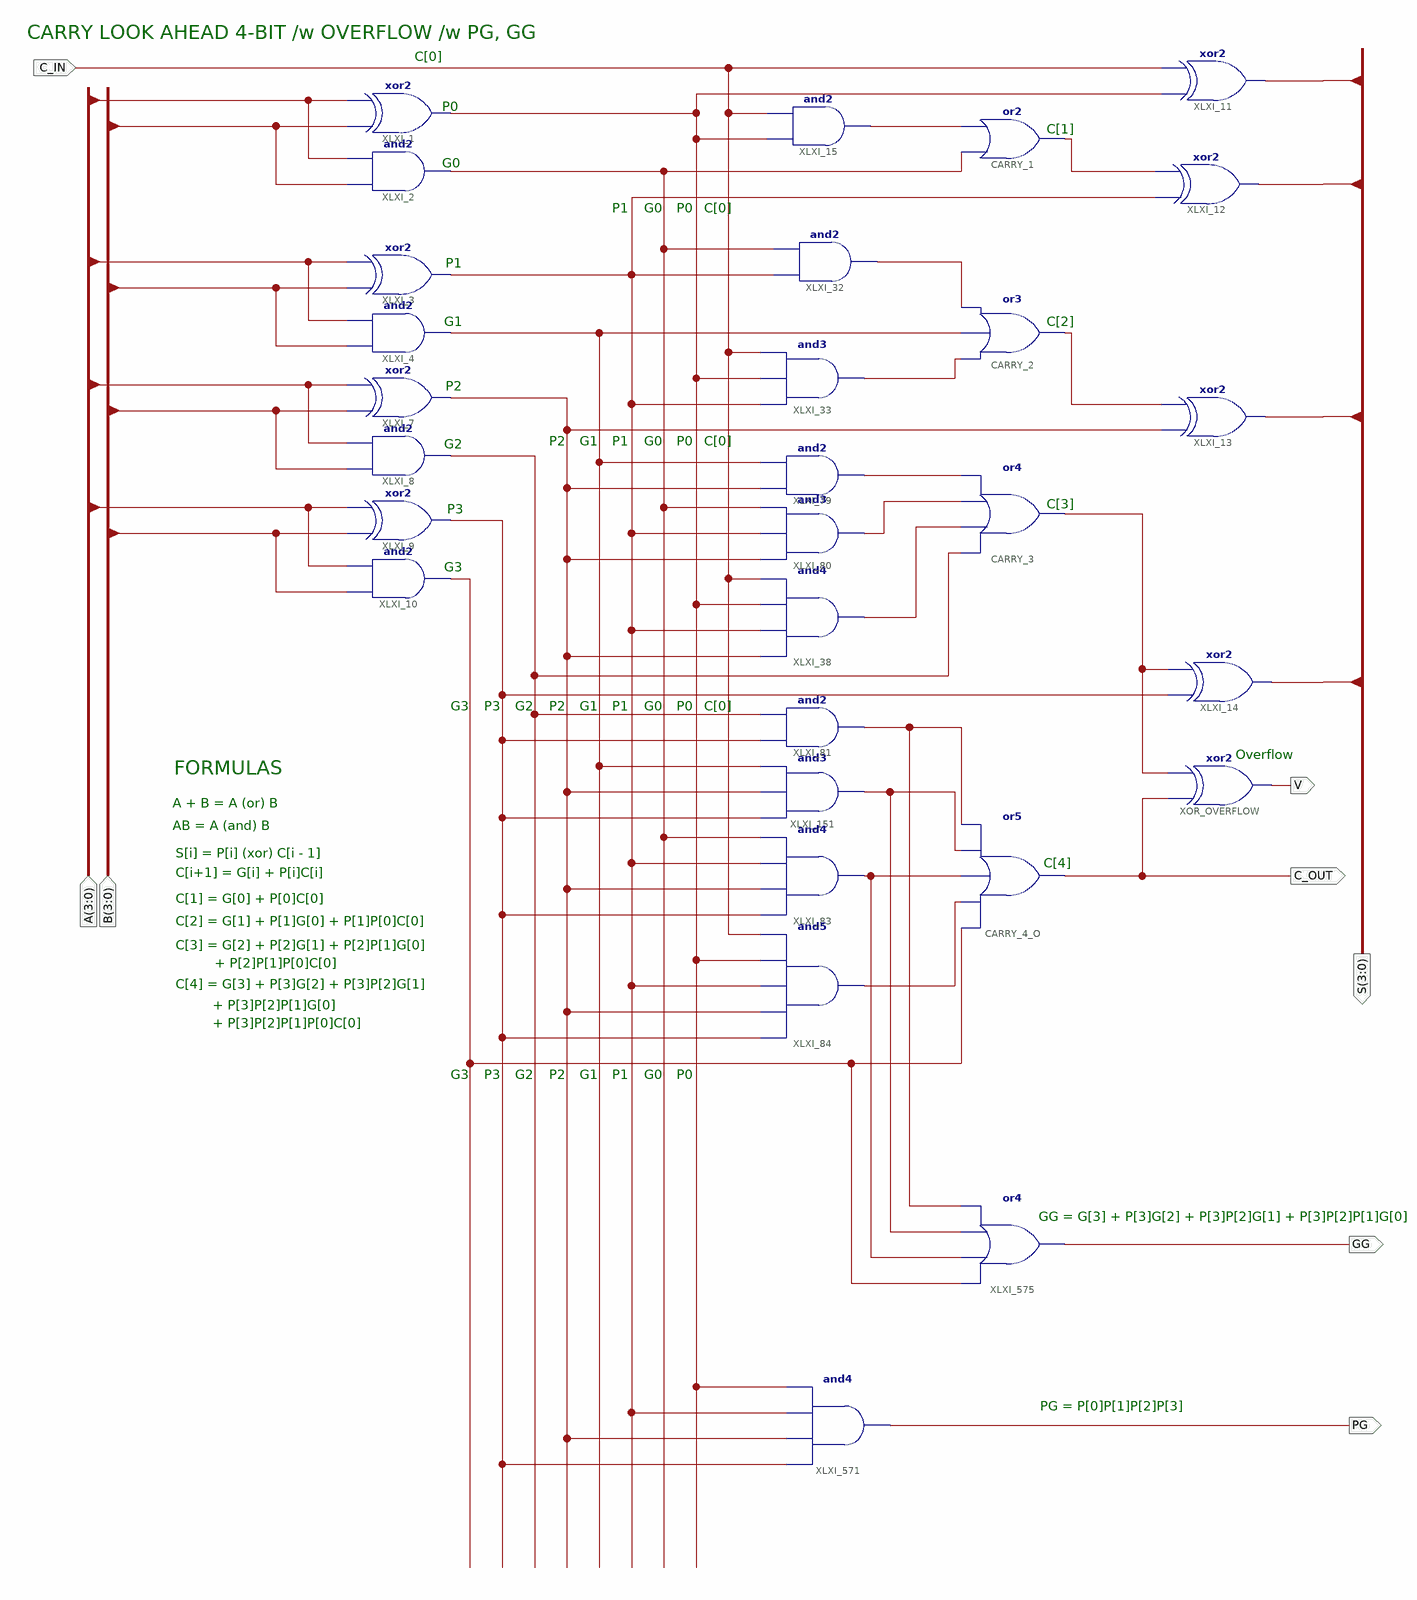
[diagram p0: schematic sheet 1]
// Xilinx ISE schematic cla4bit.sch (spartan3e) as structural Verilog: 29 symbols, 8 ports
module cla4bit (
  input  C_IN,
  input  [3:0] B,
  input  [3:0] A,
  output V,
  output C_OUT,
  output PG,
  output GG,
  output [3:0] S
);

  wire C_3, XLXN_21, XLXN_26, XLXN_43, XLXN_52, XLXN_60, XLXN_62, XLXN_66, XLXN_67, XLXN_68, XLXN_69,
       XLXN_70, XLXN_75, XLXN_143, XLXN_145, XLXN_150, XLXN_293, XLXN_1487, XLXN_1488, XLXN_1489, XLXN_1490;

  or CARRY_1 (XLXN_52, XLXN_43, XLXN_26);
  or CARRY_2 (XLXN_75, XLXN_67, XLXN_62, XLXN_66);
  and XLXI_38 (XLXN_150, XLXN_68, XLXN_60, XLXN_21, C_IN);
  and XLXI_80 (XLXN_143, XLXN_68, XLXN_60, XLXN_43);
  and XLXI_79 (XLXN_145, XLXN_68, XLXN_62);
  or CARRY_3 (C_3, XLXN_69, XLXN_150, XLXN_143, XLXN_145);
  xor XLXI_14 (S[3], XLXN_70, C_3);
  or CARRY_4_O (C_OUT, XLXN_1487, XLXN_293, XLXN_1488, XLXN_1489, XLXN_1490);
  and XLXI_15 (XLXN_26, XLXN_21, C_IN);
  and XLXI_32 (XLXN_66, XLXN_60, XLXN_43);
  and XLXI_33 (XLXN_67, XLXN_60, XLXN_21, C_IN);
  and XLXI_83 (XLXN_1488, XLXN_70, XLXN_68, XLXN_60, XLXN_43);
  and XLXI_84 (XLXN_293, XLXN_70, XLXN_68, XLXN_60, XLXN_21, C_IN);
  and XLXI_151 (XLXN_1489, XLXN_70, XLXN_68, XLXN_62);
  and XLXI_81 (XLXN_1490, XLXN_70, XLXN_69);
  xor XOR_OVERFLOW (V, C_OUT, C_3);
  and XLXI_571 (PG, XLXN_70, XLXN_68, XLXN_60, XLXN_21);
  or XLXI_575 (GG, XLXN_1487, XLXN_1488, XLXN_1489, XLXN_1490);
  and XLXI_2 (XLXN_43, B[0], A[0]);
  xor XLXI_1 (XLXN_21, B[0], A[0]);
  and XLXI_10 (XLXN_1487, B[3], A[3]);
  xor XLXI_9 (XLXN_70, B[3], A[3]);
  and XLXI_8 (XLXN_69, B[2], A[2]);
  xor XLXI_7 (XLXN_68, B[2], A[2]);
  and XLXI_4 (XLXN_62, B[1], A[1]);
  xor XLXI_3 (XLXN_60, B[1], A[1]);
  xor XLXI_11 (S[0], XLXN_21, C_IN);
  xor XLXI_12 (S[1], XLXN_60, XLXN_52);
  xor XLXI_13 (S[2], XLXN_68, XLXN_75);

  // Notes on the sheet:
  //   CARRY LOOK AHEAD 4-BIT /w OVERFLOW /w PG, GG
  //   C[0]
  //   P0
  //   C[1]
  //   G0
  //   P1
  //   G0
  //   P0
  //   C[0]
  //   P1
  //   G1
  //   C[2]
  //   P2
  //   P2
  //   G1
  //   P1
  //   G0
  //   P0
  //   C[0]
  //   G2
  //   C[3]
  //   P3
  //   G3
  //   G3
  //   P3
  //   G2
  //   P2
  //   G1
  //   P1
  //   G0
  //   P0
  //   C[0]
  //   Overflow
  //   FORMULAS
  //   A + B = A (or) B
  //   AB = A (and) B
  //   S[i] = P[i] (xor) C[i - 1]
  //   C[4]
  //   C[i+1] = G[i] + P[i]C[i]
  //   C[1] = G[0] + P[0]C[0]
  //   C[2] = G[1] + P[1]G[0] + P[1]P[0]C[0]
  //   C[3] = G[2] + P[2]G[1] + P[2]P[1]G[0]
  //   + P[2]P[1]P[0]C[0]
  //   C[4] = G[3] + P[3]G[2] + P[3]P[2]G[1]
  //   + P[3]P[2]P[1]G[0]
  //   + P[3]P[2]P[1]P[0]C[0]
  //   G3
  //   P3
  //   G2
  //   P2
  //   G1
  //   P1
  //   G0
  //   P0
  //   GG = G[3] + P[3]G[2] + P[3]P[2]G[1] + P[3]P[2]P[1]G[0]
  //   PG = P[0]P[1]P[2]P[3]
endmodule
